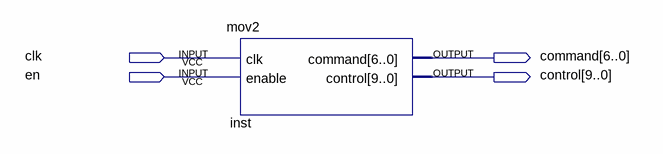
[diagram p0: schematic sheet]
// Quartus schematic test2.bdf as structural Verilog: 1 symbols, 4 pins
module test2 (
  input  clk,
  input  en,
  output [6:0] command,
  output [9:0] control
);

  mov2 inst (.clk(clk), .enable(en), .command(command), .control(control));
endmodule
